# Altium project picr22-team-placeholder-electronics.PrjPcb
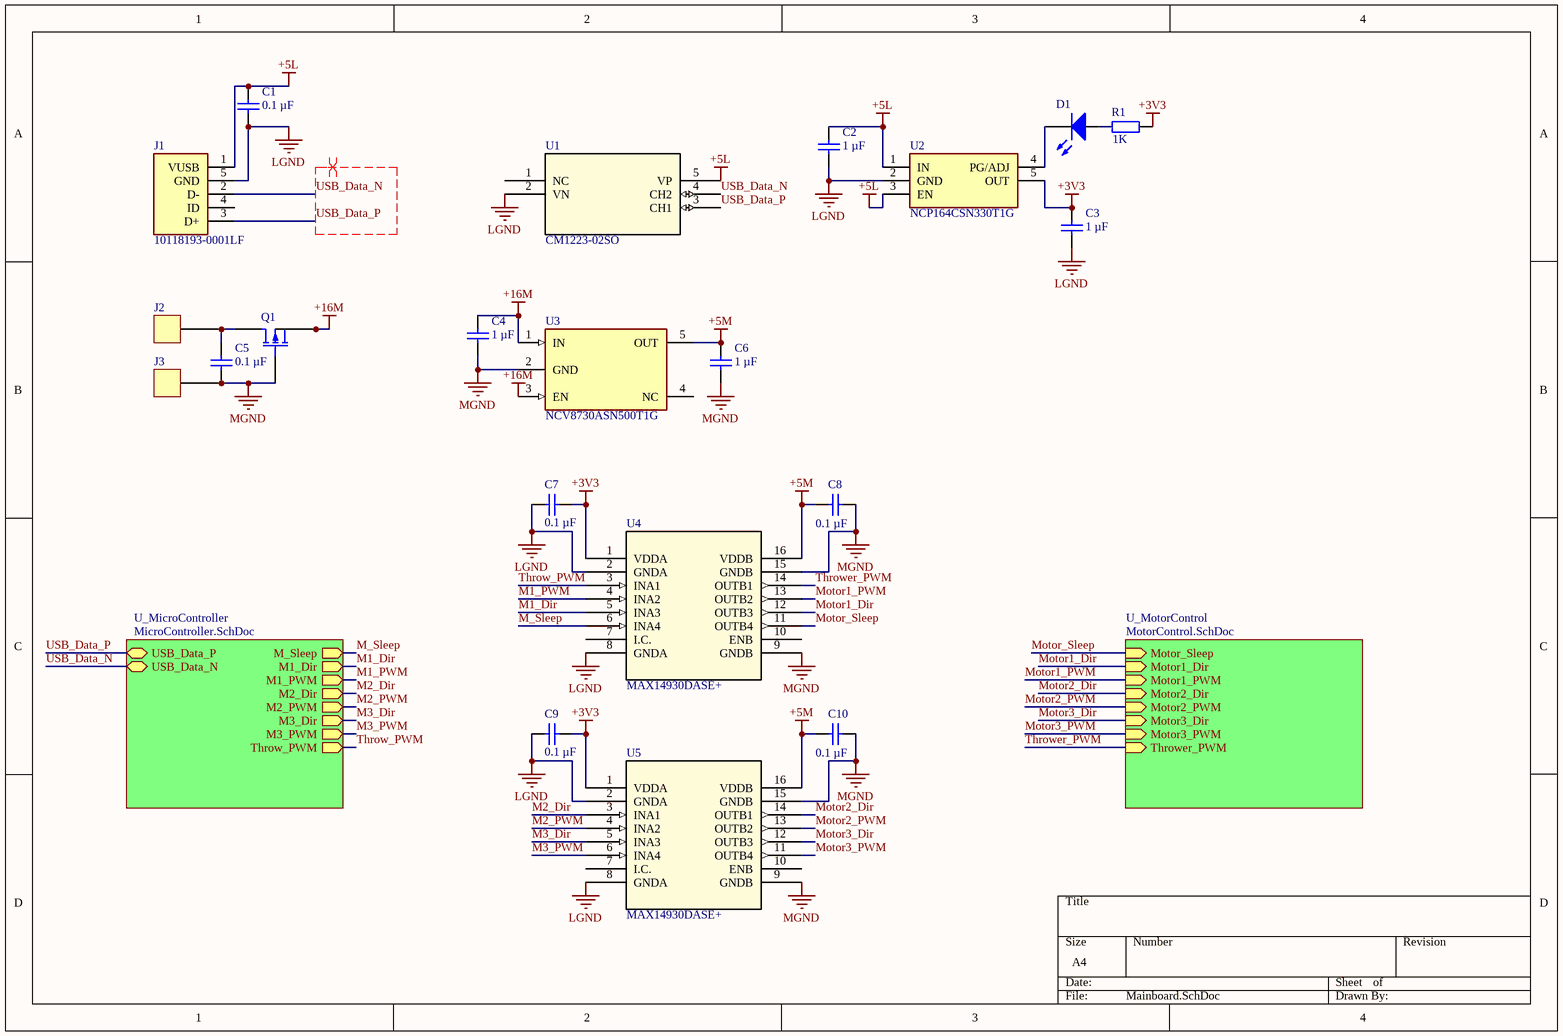
[diagram p0: Mainboard.SchDoc]
3 sheets, 77 parts. Net scope: hierarchical (ports join the sheet entries above them; power ports are global).
Board file: Board.PcbDoc
Sheets:
  Mainboard.SchDoc
    U_MotorControl = MotorControl.SchDoc
    U_MicroController = MicroController.SchDoc

## Sheet Mainboard.SchDoc
size A4; SheetNumber: 1; SheetTotal: 3

### Parts
C1  value 0.1 µF  [CAP_0603]  (hidden comment: MLCC)
C2  value 1 µF  [CAP_0603]  (hidden comment: MLCC)
C3  value 1 µF  [CAP_0603]  (hidden comment: MLCC)
C4  value 1 µF  [CAP_0603]  (hidden comment: MLCC)
C5  value 0.1 µF  [CAP_0603]  (hidden comment: MLCC)
C6  value 1 µF  [CAP_0603]  (hidden comment: MLCC)
C7  value 0.1 µF  [CAP_0603]  (hidden comment: MLCC)
C8  value 0.1 µF  [CAP_0603]  (hidden comment: MLCC)
C9  value 0.1 µF  [CAP_0603]  (hidden comment: MLCC)
C10  value 0.1 µF  [CAP_0603]  (hidden comment: MLCC)
D1  LED  [0603_GREEN]  (value not drawn)
J1  10118193-0001LF  [FCI_10118193-0001LF]
J2  Generic Power Pad  [New footprint 1]  (value not drawn)
J3  Generic Power Pad  [New footprint 1]  (value not drawn)
Q1  BUK6Y10-30P  [NXP-SOT669_N]  (value not drawn)
R1  value 1K  [RC0603N]  (hidden comment: RES)
U1  CM1223-02SO  [SOT23-5_3X1P7_ONS]
U2  NCP164CSN330T1G  [SOT95P275X110-5N]
U3  NCV8730ASN500T1G  [FP-483-MFG]
U4  MAX14930DASE+  [21-0041_S16+1_MXM]
U5  MAX14930DASE+  [21-0041_S16+1_MXM]

### Sub-sheets
U_MicroController = MicroController.SchDoc: M1_PWM (out), M_Sleep (out), M1_Dir (out), M2_Dir (out), M2_PWM (out), M3_Dir (out), M3_PWM (out), Throw_PWM (out), USB_Data_P (bidir), USB_Data_N (bidir)
U_MotorControl = MotorControl.SchDoc: Motor_Sleep (in), Motor1_Dir (in), Motor1_PWM (in), Motor2_Dir (in), Motor2_PWM (in), Motor3_Dir (in), Motor3_PWM (in), Thrower_PWM (in)

### Nets
+3V3: C3.2 C7.1 C9.1 R1.2 U2.5(OUT) U4.1(VDDA) U5.1(VDDA)
+5L: C1.2 C2.2 J1.1(VUSB) U1.5(VP) U2.1(IN) U2.3(EN)
+5M: C6.2 C8.2 C10.2 U3.5(OUT) U4.16(VDDB) U5.16(VDDB)
+16M: C4.2 Q1.1(S) Q1.2(S) Q1.3(S) U3.1(IN) U3.3(EN)
LGND: C1.1 C2.1 C3.1 C7.2 C9.2 J1.5(GND) U1.2(VN) U2.2(GND) U4.2(GNDA) U4.8(GNDA) U5.2(GNDA) U5.8(GNDA)
MGND: C4.1 C5.1 C6.1 C8.1 C10.1 J3.1 Q1.4(G) U3.2(GND) U4.9(GNDB) U4.15(GNDB) U5.9(GNDB) U5.15(GNDB)
M1_Dir: U4.5(INA3) ; sheet U_MicroController/M1_Dir
M1_PWM: U4.4(INA2) ; sheet U_MicroController/M1_PWM
M2_Dir: U5.3(INA1) ; sheet U_MicroController/M2_Dir
M2_PWM: U5.4(INA2) ; sheet U_MicroController/M2_PWM
M3_Dir: U5.5(INA3) ; sheet U_MicroController/M3_Dir
M3_PWM: U5.6(INA4) ; sheet U_MicroController/M3_PWM
M_Sleep: U4.6(INA4) ; sheet U_MicroController/M_Sleep
Motor1_Dir: U4.12(OUTB3) ; sheet U_MotorControl/Motor1_Dir
Motor1_PWM: U4.13(OUTB2) ; sheet U_MotorControl/Motor1_PWM
Motor2_Dir: U5.14(OUTB1) ; sheet U_MotorControl/Motor2_Dir
Motor2_PWM: U5.13(OUTB2) ; sheet U_MotorControl/Motor2_PWM
Motor3_Dir: U5.12(OUTB3) ; sheet U_MotorControl/Motor3_Dir
Motor3_PWM: U5.11(OUTB4) ; sheet U_MotorControl/Motor3_PWM
Motor_Sleep: U4.11(OUTB4) ; sheet U_MotorControl/Motor_Sleep
Throw_PWM: U4.3(INA1) ; sheet U_MicroController/Throw_PWM
Thrower_PWM: U4.14(OUTB1) ; sheet U_MotorControl/Thrower_PWM
USB_Data_N: J1.2(D-) U1.4(CH2) ; sheet U_MicroController/USB_Data_N
USB_Data_P: J1.3(D+) U1.3(CH1) ; sheet U_MicroController/USB_Data_P
NetC5_2: C5.2 J2.1 Q1.5(D)
NetD1_1: D1.1(A) R1.1
NetD1_2: D1.2(K) U2.4(PG/ADJ)

Not connected (* = marked no-connect by the designer): J1 4(ID); U1 1(NC); U3 4(NC); U4 7(I.C.) 10(ENB); U5 7(I.C.) 10(ENB)

### Layout directives
differential pair; differential pair class USB: USB_Data_N, USB_Data_P

### Library data of the parts
C1-C10 = CMP-059-000002-1: Multilayer Ceramic Capacitors; Tolerance: 10%; VoltageRatingDC: 5V; Component Type: Standard; Design Item ID: MLCC; Pin Count: 2; Source: Capacitors.SchLib
D1 = CMP-063-000000-1: LED Emitters; ForwardVoltage: 2V; Design Item ID: LED; Source: Leds.SchLib; Pin Count: 2; Component Type: Standard
J1 = CMP-002-000000-4: USB - micro B USB 2.0 Receptacle Connector 5 Position Surface Mount, Right Angle; Through Hole; MF: Amphenol ICC; Design Item ID: 10118193-0001LF; Package: None; SnapEDA_Link: https://www.snapeda.com/parts/10118193-0001LF/Amphenol%20FCI/view-part/2758989/?ref=snap; Value: *; MP: 10118193-0001LF; Availability: Unavailable; Pin Count: 11; Price: None; Source: SnapEDAsch.SchLib; Component Type: Standard
J2 J3 = CMP-00002-4
Q1 = CMP-011-000000-5: P-Channel Standard Level MOSFET SOT669-5; PartNumber: BUK7Y4R4-40EX; Channel Type: N; VDS [max] (V): 40; ID [max] (A): 100; Packing: Tape & Reel; Qr [typ] (nC): 18; IDM [max] (A): 521; VGSth [typ] (V): 3; Automotive Qualified: Y; PackageReference: SOT669; Pin Count: 5; PackageVersion: 13-02-27, 02/2013; Mounting Technology: Surface Mount; PackageDescription: 4-Pin Plastic Single-ended Surface Mounted Package, Body 4.9 x 3.95 mm, Pitch 1.27 mm; Component Type: Transistor; Code_JEDEC: MO-235; Design Item ID: CMP-1259-00420-1; Source: Components - 16.10.22 - 00.34.SchLib
R1 = CMP-061-000001-5: Chip Resistors; PowerRating: 0.25W; Component Type: Standard; Source: Resistors.SchLib; Pin Count: 2; Design Item ID: RES
U1 = CMP-044-000002-2: No Description Available; Mfr_Name: onsemi; RefDes: RefDes; Pin Count: 5; Copyright: Copyright (C) 2022 Ultra Librarian. All rights reserved.; Design Item ID: CM1223-02SO; Source: CM1223-02SO.SchLib; Manufacturer_Part_Number: CM1223-02SO; Type: DEV; Component Type: Standard
U2 = NCP164CSN330T1G: Integrated Circuit; Manufacturer_Name: onsemi; Datasheet Link: https://componentsearchengine.com/Datasheets/2/NCP164CSN330T1G.pdf; Height: 1.1mm; Manufacturer_Part_Number: NCP164CSN330T1G; Mouser Part Number: 863-NCP164CSN330T1G; Mouser Price/Stock: https://www.mouser.co.uk/ProductDetail/onsemi/NCP164CSN330T1G?qs=xZ%2FP%252Ba9zWqbi%2FAyy5UtoRw%3D%3D; Arrow Part Number: NCP164CSN330T1G; Arrow Price/Stock: https://www.arrow.com/en/products/ncp164csn330t1g/on-semiconductor?region=nac
U3 = NCV8730ASN500T1G: LDO Regulator TSOP-5
U4 U5 = MAX14930DASE+: No Description Available; Mfr_Name: Maxim Integrated Products; Copyright: Copyright (C) 2022 Ultra Librarian. All rights reserved.; Manufacturer_Part_Number: MAX14930DASE+; RefDes: RefDes; Type: DEV

## Sheet MotorControl.SchDoc
size A4; SheetNumber: 2; SheetTotal: 3
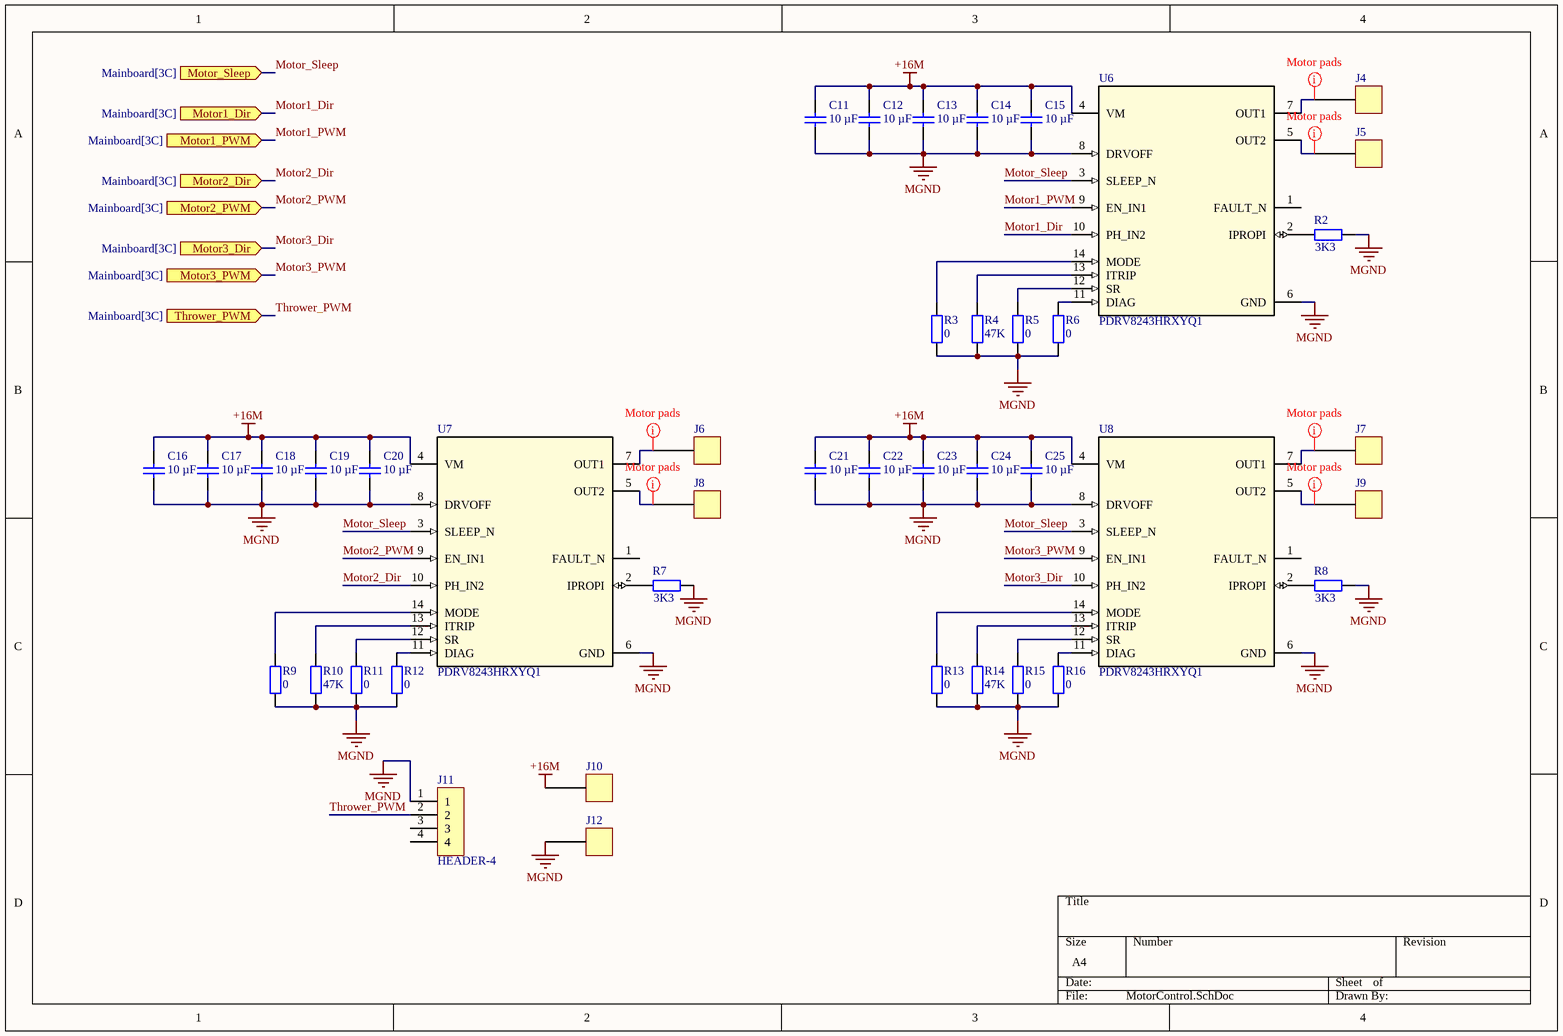
[diagram p1: MotorControl.SchDoc]

### Parts
C11  value 10 µF  [CAP_0805]  (hidden comment: MLCC)
C12  value 10 µF  [CAP_0805]  (hidden comment: MLCC)
C13  value 10 µF  [CAP_0805]  (hidden comment: MLCC)
C14  value 10 µF  [CAP_0805]  (hidden comment: MLCC)
C15  value 10 µF  [CAP_0805]  (hidden comment: MLCC)
C16  value 10 µF  [CAP_0805]  (hidden comment: MLCC)
C17  value 10 µF  [CAP_0805]  (hidden comment: MLCC)
C18  value 10 µF  [CAP_0805]  (hidden comment: MLCC)
C19  value 10 µF  [CAP_0805]  (hidden comment: MLCC)
C20  value 10 µF  [CAP_0805]  (hidden comment: MLCC)
C21  value 10 µF  [CAP_0805]  (hidden comment: MLCC)
C22  value 10 µF  [CAP_0805]  (hidden comment: MLCC)
C23  value 10 µF  [CAP_0805]  (hidden comment: MLCC)
C24  value 10 µF  [CAP_0805]  (hidden comment: MLCC)
C25  value 10 µF  [CAP_0805]  (hidden comment: MLCC)
J4  Generic Power Pad  [New footprint 1]  (value not drawn)
J5  Generic Power Pad  [New footprint 1]  (value not drawn)
J6  Generic Power Pad  [New footprint 1]  (value not drawn)
J7  Generic Power Pad  [New footprint 1]  (value not drawn)
J8  Generic Power Pad  [New footprint 1]  (value not drawn)
J9  Generic Power Pad  [New footprint 1]  (value not drawn)
J10  Generic Power Pad  [New footprint 1]  (value not drawn)
J11  HEADER-4  [MICRO-MATCH-FOB-04]
J12  Generic Power Pad  [New footprint 1]  (value not drawn)
R2  value 3K3  [RC0603N]  (hidden comment: RES)
R3  value 0  [RC0603N]  (hidden comment: RES)
R4  value 47K  [RC0603N]  (hidden comment: RES)
R5  value 0  [RC0603N]  (hidden comment: RES)
R6  value 0  [RC0603N]  (hidden comment: RES)
R7  value 3K3  [RC0603N]  (hidden comment: RES)
R8  value 3K3  [RC0603N]  (hidden comment: RES)
R9  value 0  [RC0603N]  (hidden comment: RES)
R10  value 47K  [RC0603N]  (hidden comment: RES)
R11  value 0  [RC0603N]  (hidden comment: RES)
R12  value 0  [RC0603N]  (hidden comment: RES)
R13  value 0  [RC0603N]  (hidden comment: RES)
R14  value 47K  [RC0603N]  (hidden comment: RES)
R15  value 0  [RC0603N]  (hidden comment: RES)
R16  value 0  [RC0603N]  (hidden comment: RES)
U6  PDRV8243HRXYQ1  [RXY0014A-MFG]
U7  PDRV8243HRXYQ1  [RXY0014A-MFG]
U8  PDRV8243HRXYQ1  [RXY0014A-MFG]

### Ports
Motor1_Dir (in, see Mainboard[3C]), Motor1_PWM (in, see Mainboard[3C]), Motor2_Dir (in, see Mainboard[3C]), Motor2_PWM (in, see Mainboard[3C]), Motor3_Dir (in, see Mainboard[3C]), Motor3_PWM (in, see Mainboard[3C]), Motor_Sleep (in, see Mainboard[3C]), Thrower_PWM (in, see Mainboard[3C])

### Nets
+16M: C11.2 C12.2 C13.2 C14.2 C15.2 C16.2 C17.2 C18.2 C19.2 C20.2 C21.2 C22.2 C23.2 C24.2 C25.2 J10.1 U6.4(VM) U7.4(VM) U8.4(VM)
MGND: C11.1 C12.1 C13.1 C14.1 C15.1 C16.1 C17.1 C18.1 C19.1 C20.1 C21.1 C22.1 C23.1 C24.1 C25.1 J11.1 J12.1 R2.2 R3.1 R4.1 R5.1 R6.1 R7.2 R8.2 R9.1 R10.1 R11.1 R12.1 R13.1 R14.1 R15.1 R16.1 U6.6(GND) U6.8(DRVOFF) U7.6(GND) U7.8(DRVOFF) U8.6(GND) U8.8(DRVOFF)
Motor1_Dir: U6.10(PH_IN2) ; port Motor1_Dir
Motor1_PWM: U6.9(EN_IN1) ; port Motor1_PWM
Motor2_Dir: U7.10(PH_IN2) ; port Motor2_Dir
Motor2_PWM: U7.9(EN_IN1) ; port Motor2_PWM
Motor3_Dir: U8.10(PH_IN2) ; port Motor3_Dir
Motor3_PWM: U8.9(EN_IN1) ; port Motor3_PWM
Motor_Sleep: U6.3(SLEEP_N) U7.3(SLEEP_N) U8.3(SLEEP_N) ; port Motor_Sleep
Thrower_PWM: J11.2 ; port Thrower_PWM
NetJ4_1: J4.1 U6.7(OUT1)
NetJ5_1: J5.1 U6.5(OUT2)
NetJ6_1: J6.1 U7.7(OUT1)
NetJ7_1: J7.1 U8.7(OUT1)
NetJ8_1: J8.1 U7.5(OUT2)
NetJ9_1: J9.1 U8.5(OUT2)
NetR2_1: R2.1 U6.2(IPROPI)
NetR3_2: R3.2 U6.14(MODE)
NetR4_2: R4.2 U6.13(ITRIP)
NetR5_2: R5.2 U6.12(SR)
NetR6_2: R6.2 U6.11(DIAG)
NetR7_1: R7.1 U7.2(IPROPI)
NetR8_1: R8.1 U8.2(IPROPI)
NetR9_2: R9.2 U7.14(MODE)
NetR10_2: R10.2 U7.13(ITRIP)
NetR11_2: R11.2 U7.12(SR)
NetR12_2: R12.2 U7.11(DIAG)
NetR13_2: R13.2 U8.14(MODE)
NetR14_2: R14.2 U8.13(ITRIP)
NetR15_2: R15.2 U8.12(SR)
NetR16_2: R16.2 U8.11(DIAG)

Not connected (* = marked no-connect by the designer): J11 3 4; U6 1(FAULT_N); U7 1(FAULT_N); U8 1(FAULT_N)

### Layout directives
net class Motor pads: NetJ4_1, NetJ5_1, NetJ6_1, NetJ7_1, NetJ8_1, NetJ9_1

### Library data of the parts
C11-C25 = CMP-059-000002-1: as C1 on sheet Mainboard; Component Type: Standard; Design Item ID: MLCC; Pin Count: 2; Source: Capacitors.SchLib
J4-J10 J12 = CMP-00002-4
J11 = CMP-051-000006-1: Design Item ID: HEADER-4; Component Type: Standard; Source: connectors_micromatch.SchLib; Pin Count: 4
R2-R16 = CMP-061-000001-5: Chip Resistors; PowerRating: 0.25W; Component Type: Standard; Source: Resistors.SchLib; Pin Count: 2; Design Item ID: RES
U6-U8 = CMP-030-000000-4: No Description Available; Mfr_Name: Texas Instruments; Component Type: Standard; RefDes: RefDes; Design Item ID: PDRV8243HRXYQ1; Pin Count: 14; Copyright: Copyright (C) 2022 Ultra Librarian. All rights reserved.; Manufacturer_Part_Number: PDRV8243HRXYQ1; Type: DEV; Source: PDRV8243HRXYQ1.SchLib

## Sheet MicroController.SchDoc
size A4; SheetNumber: 3; SheetTotal: 3
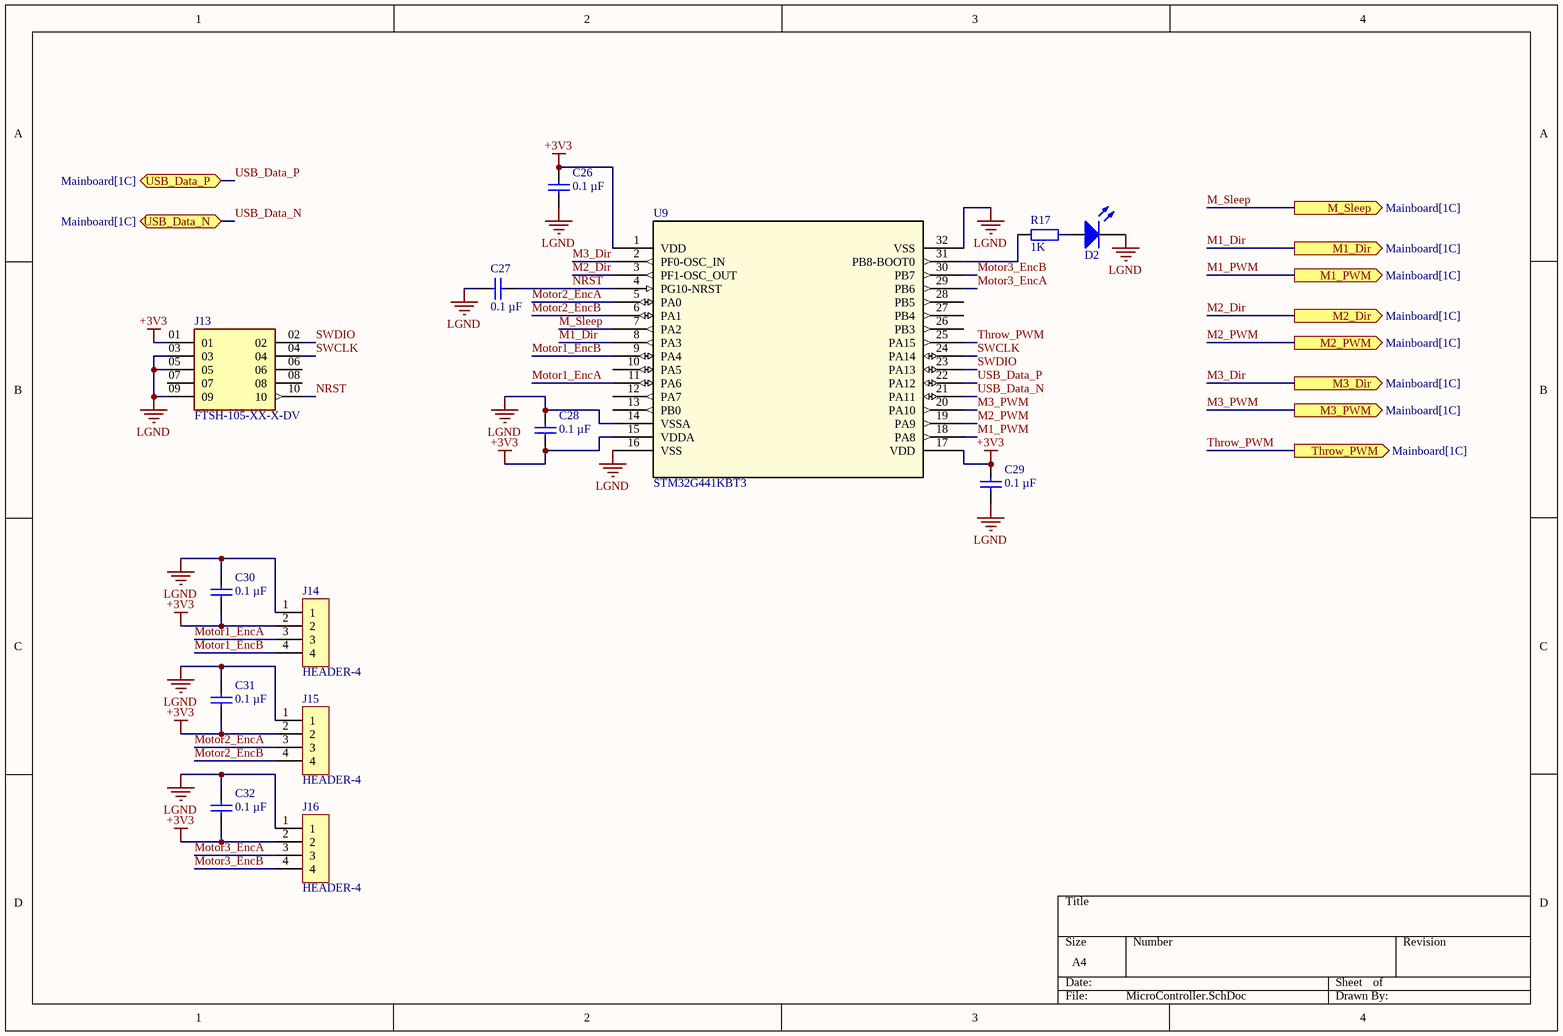
[diagram p2: MicroController.SchDoc]

### Parts
C26  value 0.1 µF  [CAP_0603]  (hidden comment: MLCC)
C27  value 0.1 µF  [CAP_0603]  (hidden comment: MLCC)
C28  value 0.1 µF  [CAP_0603]  (hidden comment: MLCC)
C29  value 0.1 µF  [CAP_0603]  (hidden comment: MLCC)
C30  value 0.1 µF  [CAP_0603]  (hidden comment: MLCC)
C31  value 0.1 µF  [CAP_0603]  (hidden comment: MLCC)
C32  value 0.1 µF  [CAP_0603]  (hidden comment: MLCC)
D2  LED  [0603_GREEN]  (value not drawn)
J13  FTSH-105-XX-X-DV  [SAMTEC_FTSH-105-XX-X-DV]
J14  HEADER-4  [MICRO-MATCH-FOB-04]
J15  HEADER-4  [MICRO-MATCH-FOB-04]
J16  HEADER-4  [MICRO-MATCH-FOB-04]
R17  value 1K  [RC0603N]  (hidden comment: RES)
U9  STM32G441KBT3  [LQFP32_7X7_STM]

### Ports
M1_Dir (out, see Mainboard[1C]), M1_PWM (out, see Mainboard[1C]), M2_Dir (out, see Mainboard[1C]), M2_PWM (out, see Mainboard[1C]), M3_Dir (out, see Mainboard[1C]), M3_PWM (out, see Mainboard[1C]), M_Sleep (out, see Mainboard[1C]), Throw_PWM (out, see Mainboard[1C]), USB_Data_N (bidir, see Mainboard[1C]), USB_Data_P (bidir, see Mainboard[1C])

### Nets
+3V3: C26.2 C28.1 C29.2 C30.1 C31.1 C32.1 J13.01 J14.2 J15.2 J16.2 U9.1(VDD) U9.15(VDDA) U9.17(VDD)
LGND: C26.1 C27.2 C28.2 C29.1 C30.2 C31.2 C32.2 D2.2(K) J13.03 J13.05 J13.09 J14.1 J15.1 J16.1 U9.14(VSSA) U9.16(VSS) U9.32(VSS)
M1_Dir: U9.8(PA3) ; port M1_Dir
M1_PWM: U9.18(PA8) ; port M1_PWM
M2_Dir: U9.3(PF1-OSC_OUT) ; port M2_Dir
M2_PWM: U9.19(PA9) ; port M2_PWM
M3_Dir: U9.2(PF0-OSC_IN) ; port M3_Dir
M3_PWM: U9.20(PA10) ; port M3_PWM
M_Sleep: U9.7(PA2) ; port M_Sleep
Motor1_EncA: J14.3 U9.11(PA6)
Motor1_EncB: J14.4 U9.9(PA4)
Motor2_EncA: J15.3 U9.5(PA0)
Motor2_EncB: J15.4 U9.6(PA1)
Motor3_EncA: J16.3 U9.29(PB6)
Motor3_EncB: J16.4 U9.30(PB7)
NRST: C27.1 J13.10 U9.4(PG10-NRST)
SWCLK: J13.04 U9.24(PA14)
SWDIO: J13.02 U9.23(PA13)
Throw_PWM: U9.25(PA15) ; port Throw_PWM
USB_Data_N: U9.21(PA11) ; port USB_Data_N
USB_Data_P: U9.22(PA12) ; port USB_Data_P
NetD2_1: D2.1(A) R17.1
NetR17_2: R17.2 U9.31(PB8-BOOT0)

Not connected (* = marked no-connect by the designer): J13 06 07 08; U9 10(PA5) 12(PA7) 13(PB0) 26(PB3) 27(PB4) 28(PB5)

### Library data of the parts
C26-C32 = CMP-059-000002-1: as C1 on sheet Mainboard; Component Type: Standard; Design Item ID: MLCC; Pin Count: 2; Source: Capacitors.SchLib
D2 = CMP-063-000000-1: LED Emitters; ForwardVoltage: 2V; Design Item ID: LED; Source: Leds.SchLib; Pin Count: 2; Component Type: Standard
J13 = CMP-004-000000-2: Connector Header Surface Mount 10 position 0.050" (1.27mm); Package: None; Component Type: Standard; Pin Count: 10; Availability: Unavailable; Value: *; Price: None; Source: FTSH-105-XX-X-DV.SchLib; Design Item ID: FTSH-105-XX-X-DV; MP: FTSH-105-XX-X-DV
J14-J16 = CMP-051-000006-1: Design Item ID: HEADER-4; Component Type: Standard; Source: connectors_micromatch.SchLib; Pin Count: 4
R17 = CMP-061-000001-5: Chip Resistors; PowerRating: 0.25W; Component Type: Standard; Source: Resistors.SchLib; Pin Count: 2; Design Item ID: RES
U9 = STM32G441KBT3: No Description Available; Mfr_Name: STMicroelectronics; Copyright: Copyright (C) 2022 Ultra Librarian. All rights reserved.; Manufacturer_Part_Number: STM32G441KBT3; RefDes: RefDes; Type: DEV

## Nets that join several sheets
+3V3: Mainboard (7 pins), MicroController (13 pins)
+16M: Mainboard (6 pins), MotorControl (19 pins)
LGND: Mainboard (12 pins), MicroController (17 pins)
MGND: Mainboard (12 pins), MotorControl (38 pins)
M1_Dir: Mainboard (U4.5), MicroController (U9.8)
M1_PWM: Mainboard (U4.4), MicroController (U9.18)
M2_Dir: Mainboard (U5.3), MicroController (U9.3)
M2_PWM: Mainboard (U5.4), MicroController (U9.19)
M3_Dir: Mainboard (U5.5), MicroController (U9.2)
M3_PWM: Mainboard (U5.6), MicroController (U9.20)
M_Sleep: Mainboard (U4.6), MicroController (U9.7)
Motor1_Dir: Mainboard (U4.12), MotorControl (U6.10)
Motor1_PWM: Mainboard (U4.13), MotorControl (U6.9)
Motor2_Dir: Mainboard (U5.14), MotorControl (U7.10)
Motor2_PWM: Mainboard (U5.13), MotorControl (U7.9)
Motor3_Dir: Mainboard (U5.12), MotorControl (U8.10)
Motor3_PWM: Mainboard (U5.11), MotorControl (U8.9)
Motor_Sleep: Mainboard (U4.11), MotorControl (U6.3 U7.3 U8.3)
Throw_PWM: Mainboard (U4.3), MicroController (U9.25)
Thrower_PWM: Mainboard (U4.14), MotorControl (J11.2)
USB_Data_N: Mainboard (J1.2 U1.4), MicroController (U9.21)
USB_Data_P: Mainboard (J1.3 U1.3), MicroController (U9.22)